# Altium schematic sheet Sheet1.SchDoc
size A4
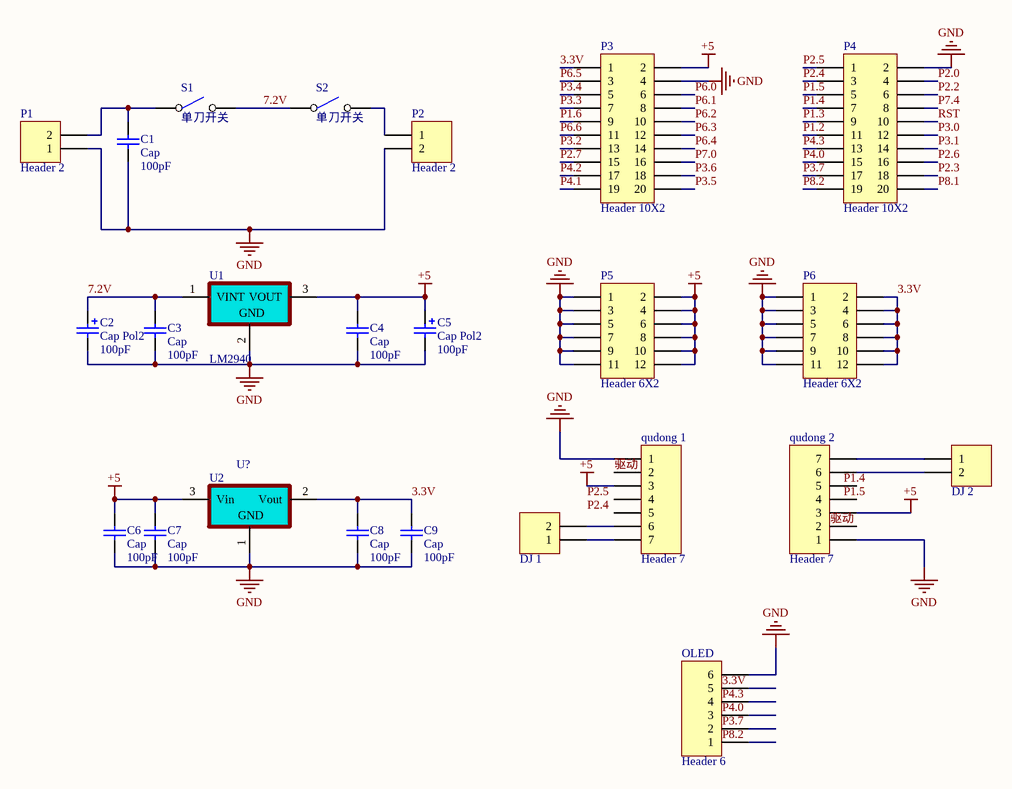
[diagram p0: Sheet1.SchDoc]

## Parts
C1  Cap  value 100pF  [CAPR5-4X5]
C2  Cap Pol2  value 100pF  [CAPR5-4X5]
C3  Cap  value 100pF  [CAPR5-4X5]
C4  Cap  value 100pF  [CAPR5-4X5]
C5  Cap Pol2  value 100pF  [CAPR5-4X5]
C6  Cap  value 100pF  [CAPR5-4X5]
C7  Cap  value 100pF  [CAPR5-4X5]
C8  Cap  value 100pF  [CAPR5-4X5]
C9  Cap  value 100pF  [CAPR5-4X5]
DJ_1  Header 2  [HDR2X1_A]  (value not drawn)
DJ_2  Header 2  [HDR2X1_A]  (value not drawn)
OLED  Header 6  [HDR1X6]
P1  Header 2  [Con 2接线端子]
P2  Header 2  [Con 2接线端子]
P3  Header 10X2  [HDR2X10]
P4  Header 10X2  [HDR2X10]
P5  Header 6X2  [HDR2X6]
P6  Header 6X2  [HDR2X6]
qudong_1  Header 7  [HDR1X7]
qudong_2  Header 7  [HDR1X7]
S1  单刀开关  [船型开关（小2脚）]
S2  单刀开关  [船型开关（小2脚）]
U1  LM2940  [T03B]
U?  U2  [T03B]

## Nets
+5: C4.2 C5.1 C6.2 C7.2 P3.2 P5.2 P5.4 P5.6 P5.8 P5.10 P5.12 qudong_1.3 qudong_2.3 U1.3(VOUT) U?.3(Vin)
GND: C1.1 C2.2 C3.1 C4.1 C5.2 C6.1 C7.1 C8.1 C9.1 OLED.6 P1.1 P2.2 P3.4 P4.2 P5.1 P5.3 P5.5 P5.7 P5.9 P5.11 P6.1 P6.3 P6.5 P6.7 P6.9 P6.11 qudong_1.1 qudong_2.1 U1.2(GND) U?.1(Gnd)
3.3V: C8.2 C9.2 P3.1 P6.2 P6.4 P6.6 P6.8 P6.10 P6.12 U?.2(Vout)
7.2V: C2.1 C3.2 S1.2 S2.1 U1.1(VINT)
P1.2: P4.11
P1.3: P4.9
P1.4: P4.7
P1.5: P4.5
P1.6: P3.9
P2.0: P4.4
P2.2: P4.6
P2.3: P4.18
P2.4: P4.3
P2.5: P4.1
P2.6: P4.16
P2.7: P3.15
P3.0: P4.12
P3.1: P4.14
P3.2: P3.13
P3.3: P3.7
P3.4: P3.5
P3.5: P3.20
P3.6: P3.18
P3.7: P4.17
P4.0: P4.15
P4.1: P3.19
P4.2: P3.17
P4.3: P4.13
P6.0: P3.6
P6.1: P3.8
P6.2: P3.10
P6.3: P3.12
P6.4: P3.14
P6.5: P3.3
P6.6: P3.11
P7.0: P3.16
P7.4: P4.8
P8.1: P4.20
P8.2: P4.19
RST: P4.10
驱动: qudong_1.2
NetC1_2: C1.2 P1.2 S1.1
NetDJ_1_1: DJ_1.1 qudong_1.7
NetDJ_1_2: DJ_1.2 qudong_1.6
NetDJ_2_1: DJ_2.1 qudong_2.7
NetDJ_2_2: DJ_2.2 qudong_2.6
NetP2_1: P2.1 S2.2

Not connected (* = marked no-connect by the designer): OLED 1 2 3 4 5; qudong_1 4 5; qudong_2 2 4 5

## Notes on the sheet
- Labels drawn without touching a wire or pin: 3.3V, P1.4, P1.5, P2.4, P2.5, P3.7, P4.0, P4.3, P8.2, 驱动
- (in symbol ASM1117) GND

## Library data of the parts
C1 C3 C4 C6-C9 = Cap: Capacitor; Published: 8-Jun-2000; LatestRevisionDate: 17-Jul-2002; LatestRevisionNote: Re-released for DXP Platform.; PackageReference: RAD-0.3; Publisher: Altium Limited; PackageDescription: Radial Cap, Thru-Hole; 2 Leads; 0.3 in Pin Spacing
C2 C5 = Cap Pol2: Polarized Capacitor (Axial); Published: 8-Jun-2000; LatestRevisionDate: 17-Jul-2002; LatestRevisionNote: Re-released for DXP Platform.; PackageReference: POLAR0.8; Publisher: Altium Limited; PackageDescription: Polarized Capacitor; 2 Leads
DJ_1 DJ_2 = Header 2: 接插件; LatestRevisionDate: 17-Jul-2002; LatestRevisionNote: Re-released for DXP Platform.; Publisher: Altium Limited
OLED = Header 6: Header, 6-Pin; LatestRevisionDate: 17-Jul-2002; LatestRevisionNote: Re-released for DXP Platform.; Publisher: Altium Limited
P1 P2 = Header 2: Header, 2-Pin; LatestRevisionDate: 17-Jul-2002; LatestRevisionNote: Re-released for DXP Platform.; Publisher: Altium Limited
P3 P4 = Header 10X2: Header, 10-Pin, Dual row; LatestRevisionDate: 17-Jul-2002; LatestRevisionNote: Re-released for DXP Platform.; Publisher: Altium Limited
P5 P6 = Header 6X2: Header, 6-Pin, Dual row; LatestRevisionDate: 17-Jul-2002; LatestRevisionNote: Re-released for DXP Platform.; Publisher: Altium Limited
qudong_1 qudong_2 = Header 7: Header, 7-Pin; LatestRevisionDate: 17-Jul-2002; LatestRevisionNote: Re-released for DXP Platform.; Publisher: Altium Limited
U? = ASM1117: ASM1117系列SOT-223封装稳压芯片